# Altium schematic sheet Page-3.schdoc: ETHERNET PHY 10/100
size 308 x 187 mm; CompanyName: InSYS; DrawnBy: NaveenKumar; Revision: 2.0; SheetNumber: 3; SheetTotal: 10; Title2: Gateway
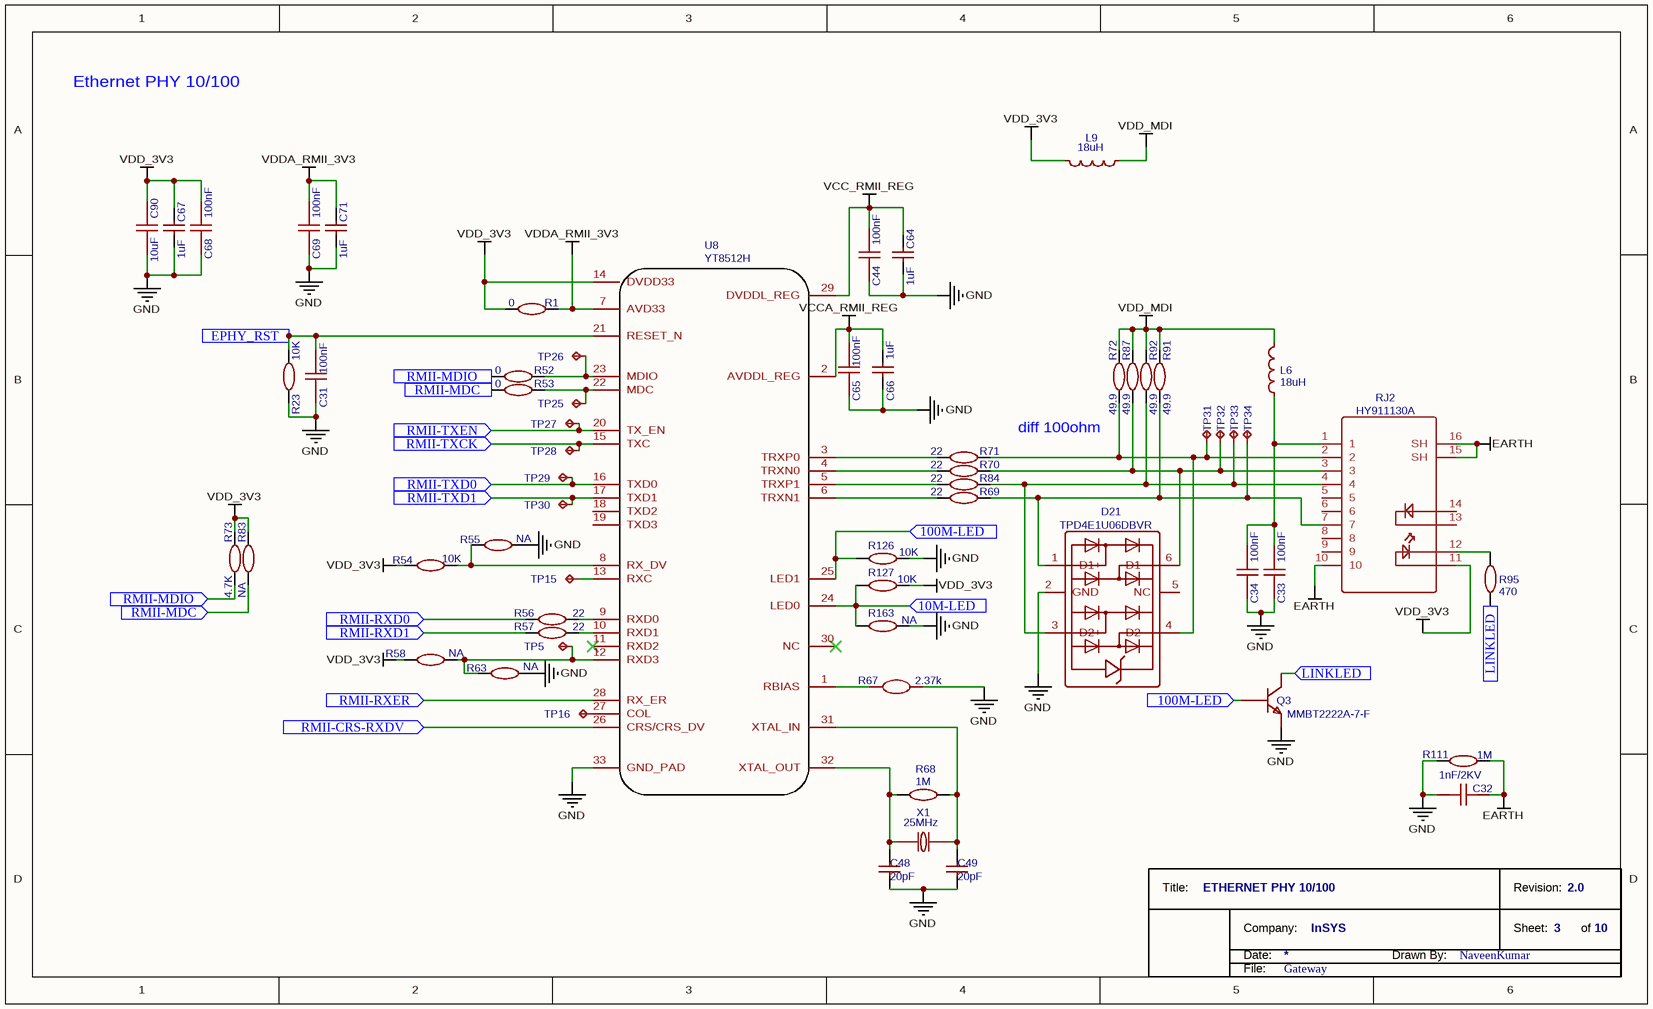
[diagram p0: Page-3.schdoc]

## Parts
*  TitleBlock_1  (value not drawn)  (graphical)
C31  100nF  [GWAY_Capacitor_0603]
C32  1nF/2KV  [GWAY_Capacitor_1206]
C33  100nF  [GWAY_Capacitor_0603]
C34  100nF  [GWAY_Capacitor_0603]
C44  100nF  [GWAY_Capacitor_0603]
C48  20pF  [GWAY_Capacitor_0603]
C49  20pF  [GWAY_Capacitor_0603]
C64  1uF  [GWAY_Capacitor_0603]
C65  100nF  [GWAY_Capacitor_0603]
C66  1uF  [GWAY_Capacitor_0603]
C67  1uF  [GWAY_Capacitor_0603]
C68  100nF  [GWAY_Capacitor_0603]
C69  100nF  [GWAY_Capacitor_0603]
C71  1uF  [GWAY_Capacitor_0603]
C90  10uF  [GWAY_Capacitor_0805]
D21  TPD4E1U06DBVR  [GWAY_SOT23-6PIN]
L6  18uH  [GWAY_FerriteeBEAD_0805_C2012X105N]
L9  18uH  [GWAY_FerriteeBEAD_0805_C2012X105N]
Q3  MMBT2222A-7-F  [GWAY_SOT23-3PIN]
R1  0  [GWAY_Resistor_0603]
R23  10K  [GWAY_Resistor_0603]
R52  0  [GWAY_Resistor_0603]
R53  0  [GWAY_Resistor_0603]
R54  10K  [GWAY_Resistor_0603]
R55  NA  [GWAY_Resistor_0603]
R56  22  [GWAY_Resistor_0603]
R57  22  [GWAY_Resistor_0603]
R58  NA  [GWAY_Resistor_0603]
R63  NA  [GWAY_Resistor_0603]
R67  2.37k  [GWAY_Resistor_0603]
R68  1M  [GWAY_Resistor_0603]
R69  22  [GWAY_Resistor_0603]
R70  22  [GWAY_Resistor_0603]
R71  22  [GWAY_Resistor_0603]
R72  49.9  [GWAY_Resistor_0603]
R73  4.7K  [GWAY_Resistor_0603]
R83  NA  [GWAY_Resistor_0603]
R84  22  [GWAY_Resistor_0603]
R87  49.9  [GWAY_Resistor_0603]
R91  49.9  [GWAY_Resistor_0603]
R92  49.9  [GWAY_Resistor_0603]
R95  470  [GWAY_Resistor_0603]
R111  1M  [GWAY_Resistor_0603]
R126  10K  [GWAY_Resistor_0603]
R127  10K  [GWAY_Resistor_0603]
R163  NA  [GWAY_Resistor_0603]
RJ2  HY911130A  [GWay_HY911130AE]
TP5  TP-052-TJ  [GWAY_TESTPOINT1]  (value not drawn)
TP15  TP-052-TJ  [GWAY_TESTPOINT1]  (value not drawn)
TP16  TP-052-TJ  [GWAY_TESTPOINT1]  (value not drawn)
TP25  TP-052-TJ  [GWAY_TESTPOINT1]  (value not drawn)
TP26  TP-052-TJ  [GWAY_TESTPOINT1]  (value not drawn)
TP27  TP-052-TJ  [GWAY_TESTPOINT1]  (value not drawn)
TP28  TP-052-TJ  [GWAY_TESTPOINT1]  (value not drawn)
TP29  TP-052-TJ  [GWAY_TESTPOINT1]  (value not drawn)
TP30  TP-052-TJ  [GWAY_TESTPOINT1]  (value not drawn)
TP31  TP-052-TJ  [GWAY_TESTPOINT1]  (value not drawn)
TP32  TP-052-TJ  [GWAY_TESTPOINT1]  (value not drawn)
TP33  TP-052-TJ  [GWAY_TESTPOINT1]  (value not drawn)
TP34  TP-052-TJ  [GWAY_TESTPOINT1]  (value not drawn)
U8  YT8512H  [GWAY_QFN_32Pin_5X5X1mm]
X1  25MHz  [GWAY_Crystal_SMD_HC49S]

## Ports
10M-LED (in), 100M-LED (in), EPHY_RST (in), LINKLED (in), RMII-CRS-RXDV (in), RMII-MDC (in), RMII-MDIO (in), RMII-RXD0 (in), RMII-RXD1 (in), RMII-RXER (in), RMII-TXCK (in), RMII-TXD0 (in), RMII-TXD1 (in), RMII-TXEN (in)

## Nets
EARTH: C32.1 R111.2 RJ2.10 RJ2.15(SH) RJ2.16(SH)
GND: C31.2 C32.2 C33.2 C34.2 C44.2 C48.1 C49.1 C64.2 C65.2 C66.1 C67.2 C68.2 C69.2 C71.2 C90.1 D21.2(GND) Q3.2(E) R23.2 R55.2 R63.2 R67.2 R111.1 R126.2 R163.2 U8.33(GND_PAD)
VCC_RMII_REG: C44.1 C64.1 U8.29(DVDDL_REG)
VCCA_RMII_REG: C65.1 C66.2 U8.2(AVDDL_REG)
VDD_3V3: C67.1 C68.1 C90.2 L9.2 R1.2 R54.1 R58.1 R73.2 R83.2 R127.2 RJ2.11 U8.14(DVDD33)
VDD_MDI: L6.2 L9.1 R72.2 R87.2 R91.2 R92.2
VDDA_RMII_3V3: C69.1 C71.1 R1.1 U8.7(AVD33)
10M-LED: R127.1 R163.1 U8.24(LED0) ; port 10M-LED
100M-LED: Q3.1(B) R126.1 U8.25(LED1) ; port 100M-LED
EPHY_RST: C31.1 R23.1 U8.21(RESET_N) ; port EPHY_RST
LINKLED: Q3.3(C) R95.1 ; port LINKLED
RMII-CRS-RXDV: U8.26(CRS/CRS_DV) ; port RMII-CRS-RXDV
RMII-MDC: R53.2 R83.1 ; port RMII-MDC
RMII-MDIO: R52.2 R73.1 ; port RMII-MDIO
RMII-RXD0: R56.1 ; port RMII-RXD0
RMII-RXD1: R57.1 ; port RMII-RXD1
RMII-RXER: U8.28(RX_ER) ; port RMII-RXER
RMII-TXCK: TP28.1 U8.15(TXC) ; port RMII-TXCK
RMII-TXD0: TP29.1 U8.16(TXD0) ; port RMII-TXD0
RMII-TXD1: TP30.1 U8.17(TXD1) ; port RMII-TXD1
RMII-TXEN: TP27.1 U8.20(TX_EN) ; port RMII-TXEN
NetC33_1: C33.1 C34.1 L6.1 RJ2.1
NetC48_2: C48.2 R68.1 U8.32(XTAL_OUT) X1.1
NetC49_2: C49.2 R68.2 U8.31(XTAL_IN) X1.2
NetD21_1: D21.1(D1+) R69.2 R91.1 RJ2.7 TP34.1
NetD21_3: D21.3(D2+) R84.2 R92.1 RJ2.4 TP33.1
NetD21_4: D21.4(D2-) R71.2 R72.1 RJ2.2 TP31.1
NetD21_6: D21.6(D1-) R70.2 R87.1 RJ2.3 TP32.1
NetR52_1: R52.1 TP26.1 U8.23(MDIO)
NetR53_1: R53.1 TP25.1 U8.22(MDC)
NetR54_2: R54.2 R55.1 U8.8(RX_DV)
NetR56_2: R56.2 U8.9(RXD0)
NetR57_2: R57.2 U8.10(RXD1)
NetR58_2: R58.2 R63.1 TP5.1 U8.12(RXD3)
NetR67_1: R67.1 U8.1(RBIAS)
NetR69_1: R69.1 U8.6(TRXN1)
NetR70_1: R70.1 U8.4(TRXN0)
NetR71_1: R71.1 U8.3(TRXP0)
NetR84_1: R84.1 U8.5(TRXP1)
NetR95_2: R95.2 RJ2.12
NetTP15_1: TP15.1 U8.13(RXC)
NetTP16_1: TP16.1 U8.27(COL)

Not connected (* = marked no-connect by the designer): D21 5(NC); RJ2 5 6 8 9 13 14; U8 11(RXD2)* 18(TXD2) 19(TXD3) 30(NC)*

## Notes on the sheet
- Ethernet PHY 10/100
- diff 100ohm
- (in symbol TitleBlock_1) Title:; Revision:; Company:; Sheet:; of; Date:; Drawn By:; File:

## Library data of the parts
* = TitleBlock_1: TitleBlock  No-2; TitleName: *; Company: *; Drawn By: *; File: *
C31 C33 C34 C44 C65 C68 C69 = 100nF: Manufacturer: SAMSUNG; Manufacturer Part: CL10B104KB8NNNC; nameAlias: Capacitance; Supplier: LCSC; Supplier Part: C1591; spicePre: C; spiceSymbolName: CL10B104KB8NNNC
C32 = 1nF/2KV: Manufacturer: Walsin Tech Corp; Manufacturer Part: 1206B102K202CT; nameAlias: Capacitance; Contributor: LCSC; Supplier: LCSC; Supplier Part: C303946; spicePre: C; spiceSymbolName: 1206B102K202CT
C48 C49 = 20pF: Manufacturer Part: CL10C200JB8NNNC; Manufacturer: SAMSUNG; nameAlias: Capacitance; SMT Type: Basic; Supplier: LCSC; LCSC Assembly: Yes; Supplier Part: C1648; spicePre: C; spiceSymbolName: CL10C200JB8NNNC
C64 C67 C71 = 1uF: Manufacturer Part: CL10B105KA8NNNC; Manufacturer: SAMSUNG(三星); nameAlias: Capacitance; Supplier: LCSC; Supplier Part: C29936; JLCPCB Part Class: Extended Part; spicePre: C; spiceSymbolName: CL10B105KA8NNNC
C66 = 1uF: Manufacturer Part: CL10A105KO8NNNC; Manufacturer: SAMSUNG; nameAlias: Capacitance; Supplier: LCSC; Supplier Part: C1592; spicePre: C; spiceSymbolName: CL10A105KO8NNNC
C90 = 10uF: Manufacturer: SAMSUNG(三星); Manufacturer Part: CL21B106KOQNNNE; nameAlias: Capacitance; Supplier: LCSC; Supplier Part: C95841; JLCPCB Part Class: Extended Part; spicePre: C; spiceSymbolName: CL21B106KOQNNNE
D21 = TPD4E1U06DBVR: Manufacturer: TI(德州仪器); Contributor: LCSC; Supplier: LCSC; Supplier Part: C124691; Manufacturer Part: TPD4E1U06DBVR; JLCPCB Part Class: Extended Part; spicePre: D; spiceSymbolName: TPD4E1U06DBVR
L6 L9 = 18uH: Manufacturer Part: MLI2012-180; Manufacturer: ReliaPro; nameAlias: Inductance; Supplier: LCSC; Supplier Part: C42027; JLCPCB Part Class: Extended Part; spicePre: L; spiceSymbolName: MLI2012-180
Q3 = MMBT2222A-7-F: Manufacturer: DIODES(美台); Contributor: LCSC; Supplier: LCSC; Supplier Part: C94515; Manufacturer Part: MMBT2222A-7-F; JLCPCB Part Class: Extended Part; spicePre: Q; spiceSymbolName: MMBT2222A-7-F
R1 R52 R53 = 0: Manufacturer: YAGEO; Manufacturer Part: RC0603FR-070RL; nameAlias: Resistance (Ohms); Supplier: LCSC; Supplier Part: C100044; spicePre: R; spiceSymbolName: RC0603FR-070RL
R23 R54 R126 R127 = 10K: Manufacturer: YAGEO; Manufacturer Part: RC0603JR-0710KL; nameAlias: Resistance (Ohms); Supplier: LCSC; Supplier Part: C99198; spicePre: R; spiceSymbolName: RC0603JR-0710KL
R55 R58 R63 R163 = NA: Manufacturer: YAGEO; Manufacturer Part: RC0603JR-0710KL; nameAlias: Resistance (Ohms); Supplier: LCSC; Supplier Part: C99198; spicePre: R; spiceSymbolName: RC0603JR-0710KL
R56 R57 R69-R71 R84 = 22: Manufacturer: YAGEO; Manufacturer Part: RC0603FR-0722RL; nameAlias: Resistance (Ohms); Supplier: LCSC; Supplier Part: C107701; spicePre: R; spiceSymbolName: RC0603FR-0722RL
R67 = 2.37k: Manufacturer: YAGEO(国巨); Manufacturer Part: RC0603FR-072K37L; Contributor: LCSC; Resistance: 2.37kΩ; Supplier: LCSC; Supplier Part: C482793; JLCPCB Part Class: Extended Part; spicePre: R; spiceSymbolName: RC0603FR-072K37L
R68 = 1M: Manufacturer: YAGEO(国巨); Manufacturer Part: AC0603FR-071ML; nameAlias: Resistance (Ohms); Resistance: 1MΩ; Supplier: LCSC; Supplier Part: C116678; JLCPCB Part Class: Extended Part; spicePre: R; spiceSymbolName: AC0603FR-071ML
R72 R87 R91 R92 = 49.9: Manufacturer: YAGEO(国巨); Manufacturer Part: RC0603FR-0749R9L; nameAlias: Resistance (Ohms); Resistance: 49.9Ω; Supplier: LCSC; Supplier Part: C114625; JLCPCB Part Class: Extended Part; spicePre: R; spiceSymbolName: RC0603FR-0749R9L
R73 = 4.7K: Manufacturer: YAGEO(国巨); Manufacturer Part: RC0603FR-074K7L; nameAlias: Resistance (Ohms); Resistance: 4.7kΩ; Supplier: LCSC; Supplier Part: C99782; JLCPCB Part Class: Extended Part; spicePre: R; spiceSymbolName: RC0603FR-074K7L
R83 = NA: Manufacturer: YAGEO(国巨); Manufacturer Part: RC0603FR-074K7L; nameAlias: Resistance (Ohms); Resistance: 4.7kΩ; Supplier: LCSC; Supplier Part: C99782; JLCPCB Part Class: Extended Part; spicePre: R; spiceSymbolName: RC0603FR-074K7L
R95 = 470: Manufacturer: YAGEO; Manufacturer Part: RC0603FR-07470RL; nameAlias: Resistance (Ohms); Resistance: 470Ω; Supplier: LCSC; Supplier Part: C114669; JLCPCB Part Class: Extended Part; spicePre: R; spiceSymbolName: RC0603FR-07470RL
R111 = 1M: Manufacturer: YAGEO; Manufacturer Part: RC0603FR-071ML; nameAlias: Resistance (Ohms); Supplier: LCSC; Supplier Part: C105578; spicePre: R; spiceSymbolName: RC0603FR-071ML
RJ2 = HY911130A: Manufacturer: HANRUN(汉仁); Supplier: LCSC; Manufacturer Part: HY911130A; Supplier Part: C55679; JLCPCB Part Class: Extended Part; spicePre: R; spiceSymbolName: HY911130A
U8 = YT8512H: Contributor: orbeebabu; Manufacturer: YT8512H; Supplier: LCSC; Supplier Part: C2685350; spicePre: U; spiceSymbolName: YT8512H
X1 = 25MHz: Manufacturer: TXC; Manufacturer Part: 9C2506LCSC-EEK2S; nameAlias: Frequency; Supplier: LCSC; Supplier Part: C90942; spicePre: X; spiceSymbolName: 9C2506LCSC-EEK2S
TP5 TP15 TP16 TP25-TP34 = TP-052-TJ: Manufacturer Part: ?; spicePre: T